# EasyEDA Pro project MSDRv2.eprj, schematic Schematic3
Board Name: Board1; Create Date: 2025-01-03; Page Name: P1; Project Name: MSDRv2; Schematic Name: Schematic3; Update Date: 2025-01-03; Company: EasyEDA.com; Drawn: EasyEDA; Page Size: A4; Part Number: JLCPCB-002; Reviewed: EasyEDA; Version: V0.1
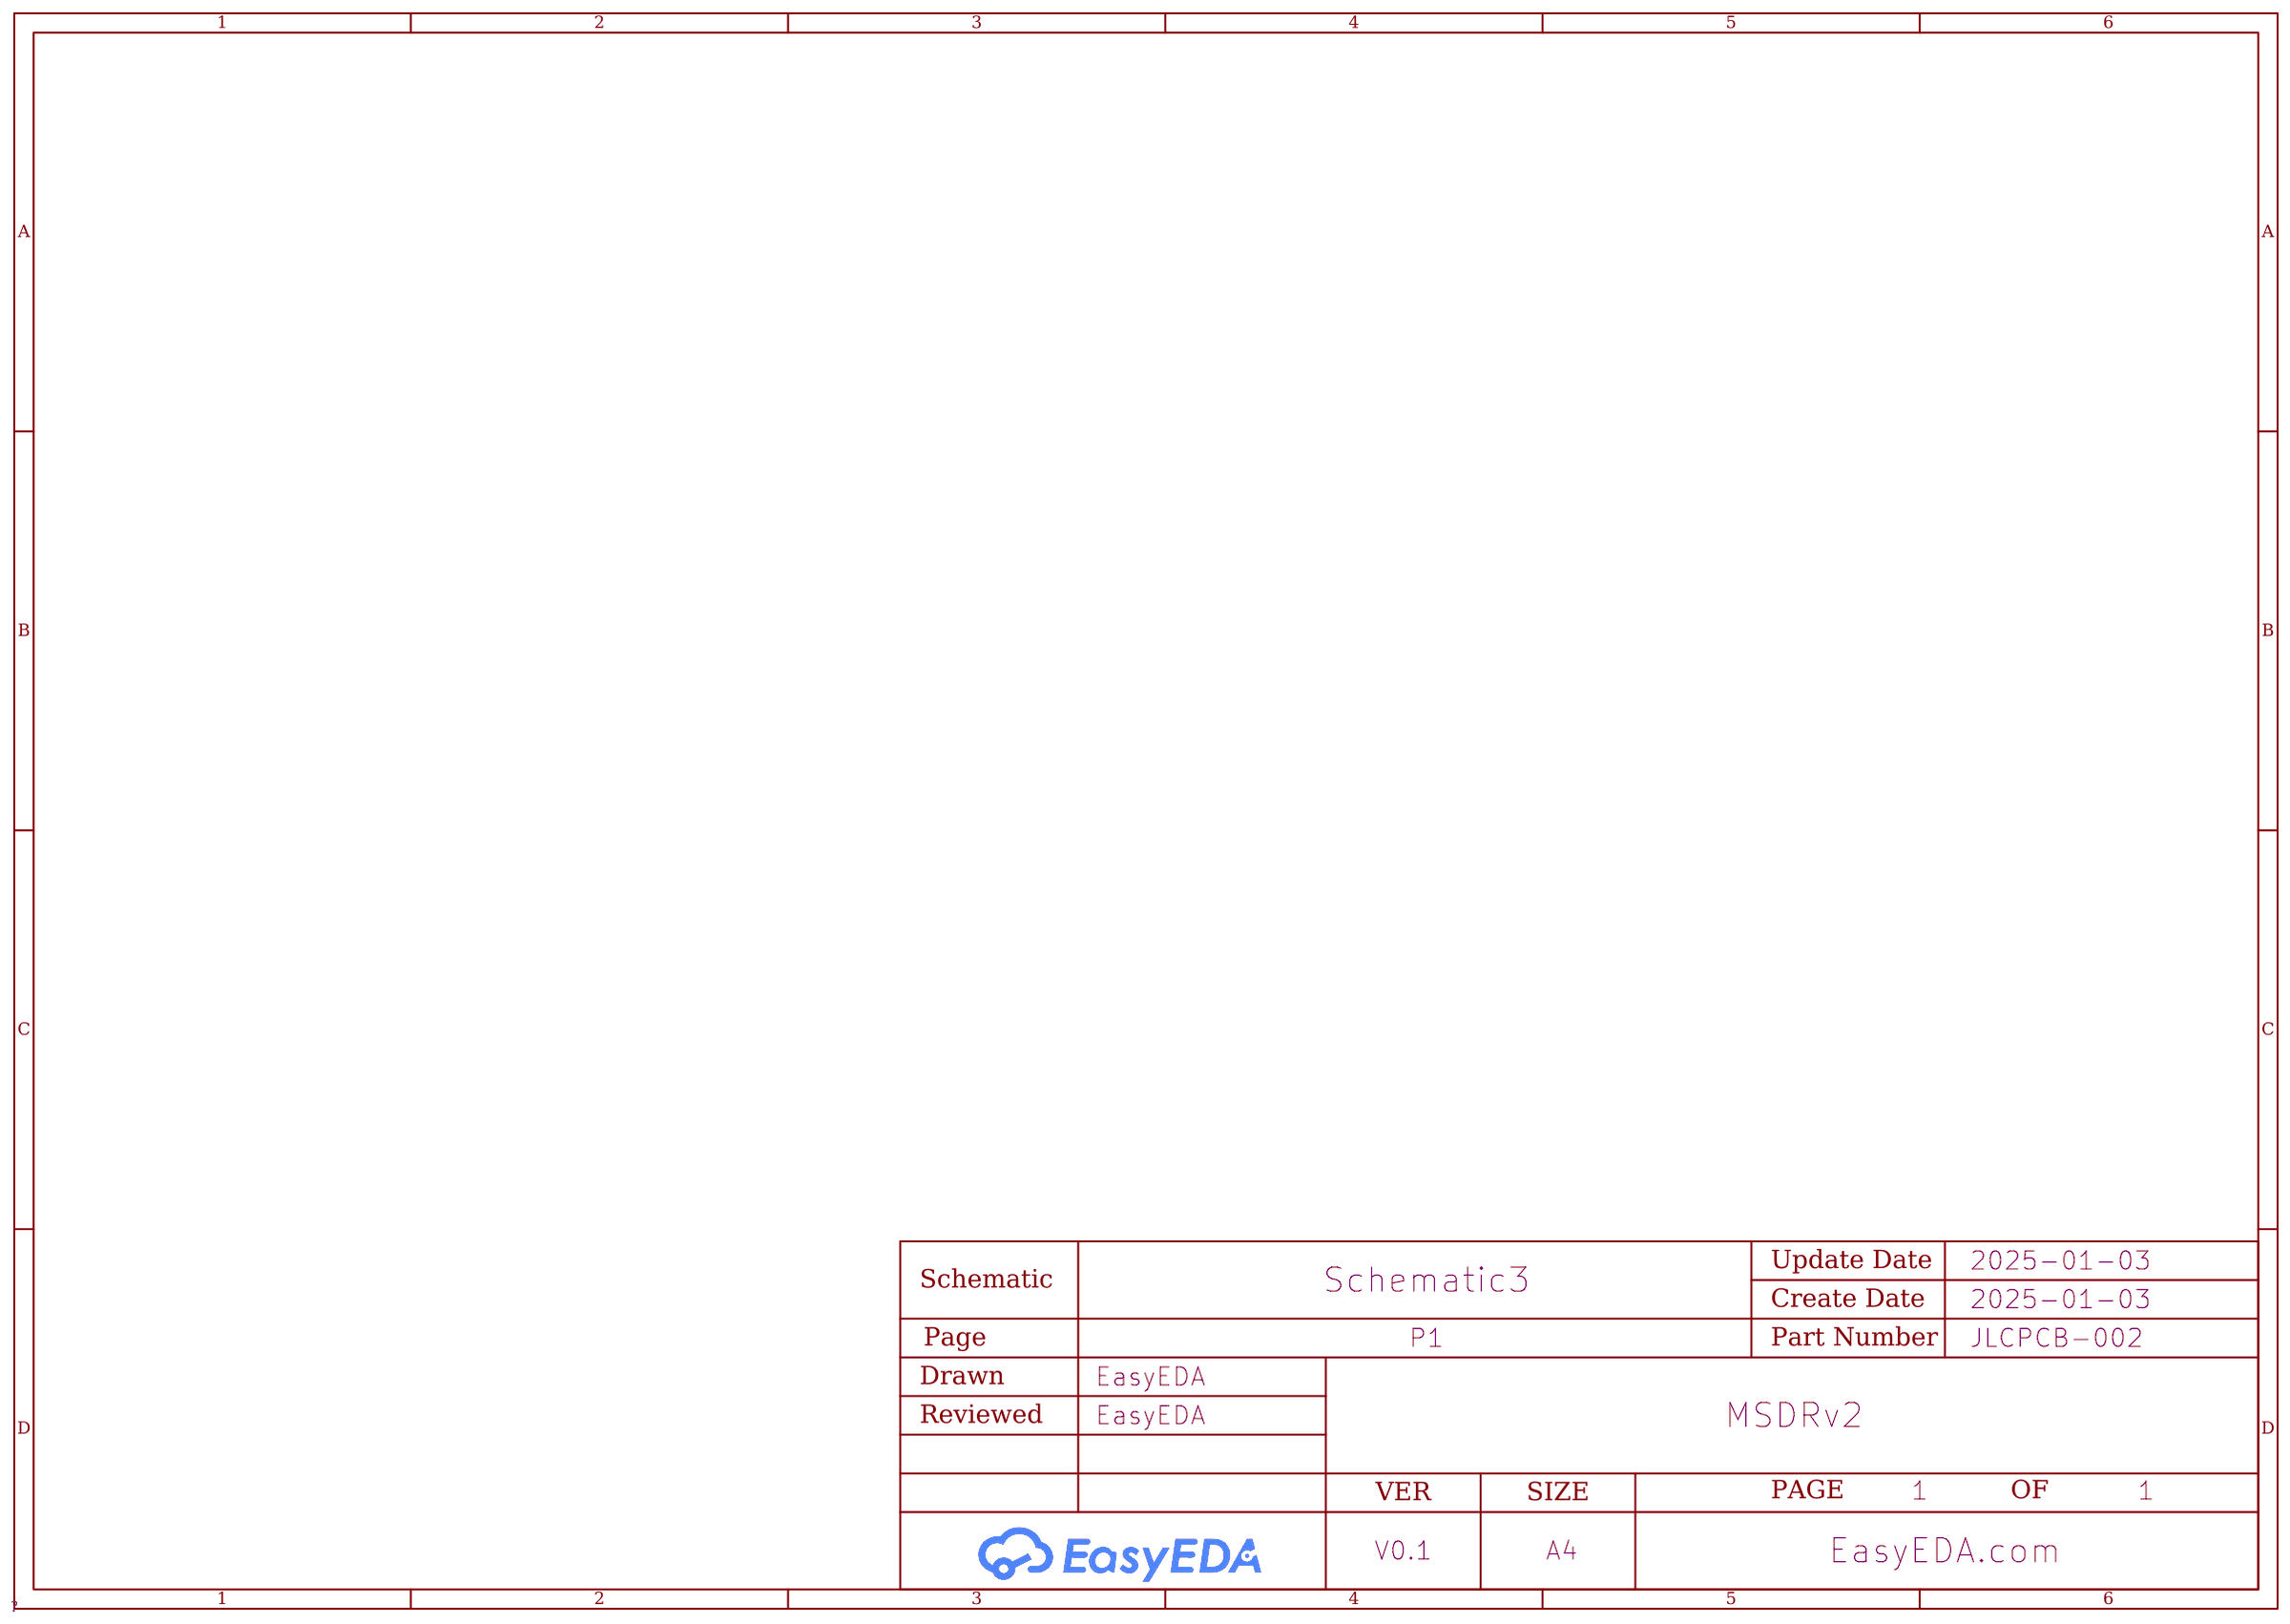
[diagram p5: schematic sheet]

## Parts
CBB1  -
CBB2  -
CBB3  -

## Nets
Net-(CBB1-): CBB1.(TXQN) CBB2.(OUT4) CBB3.(OUT4)
